# EAGLE design mainboard (EAGLE 9.6.2)
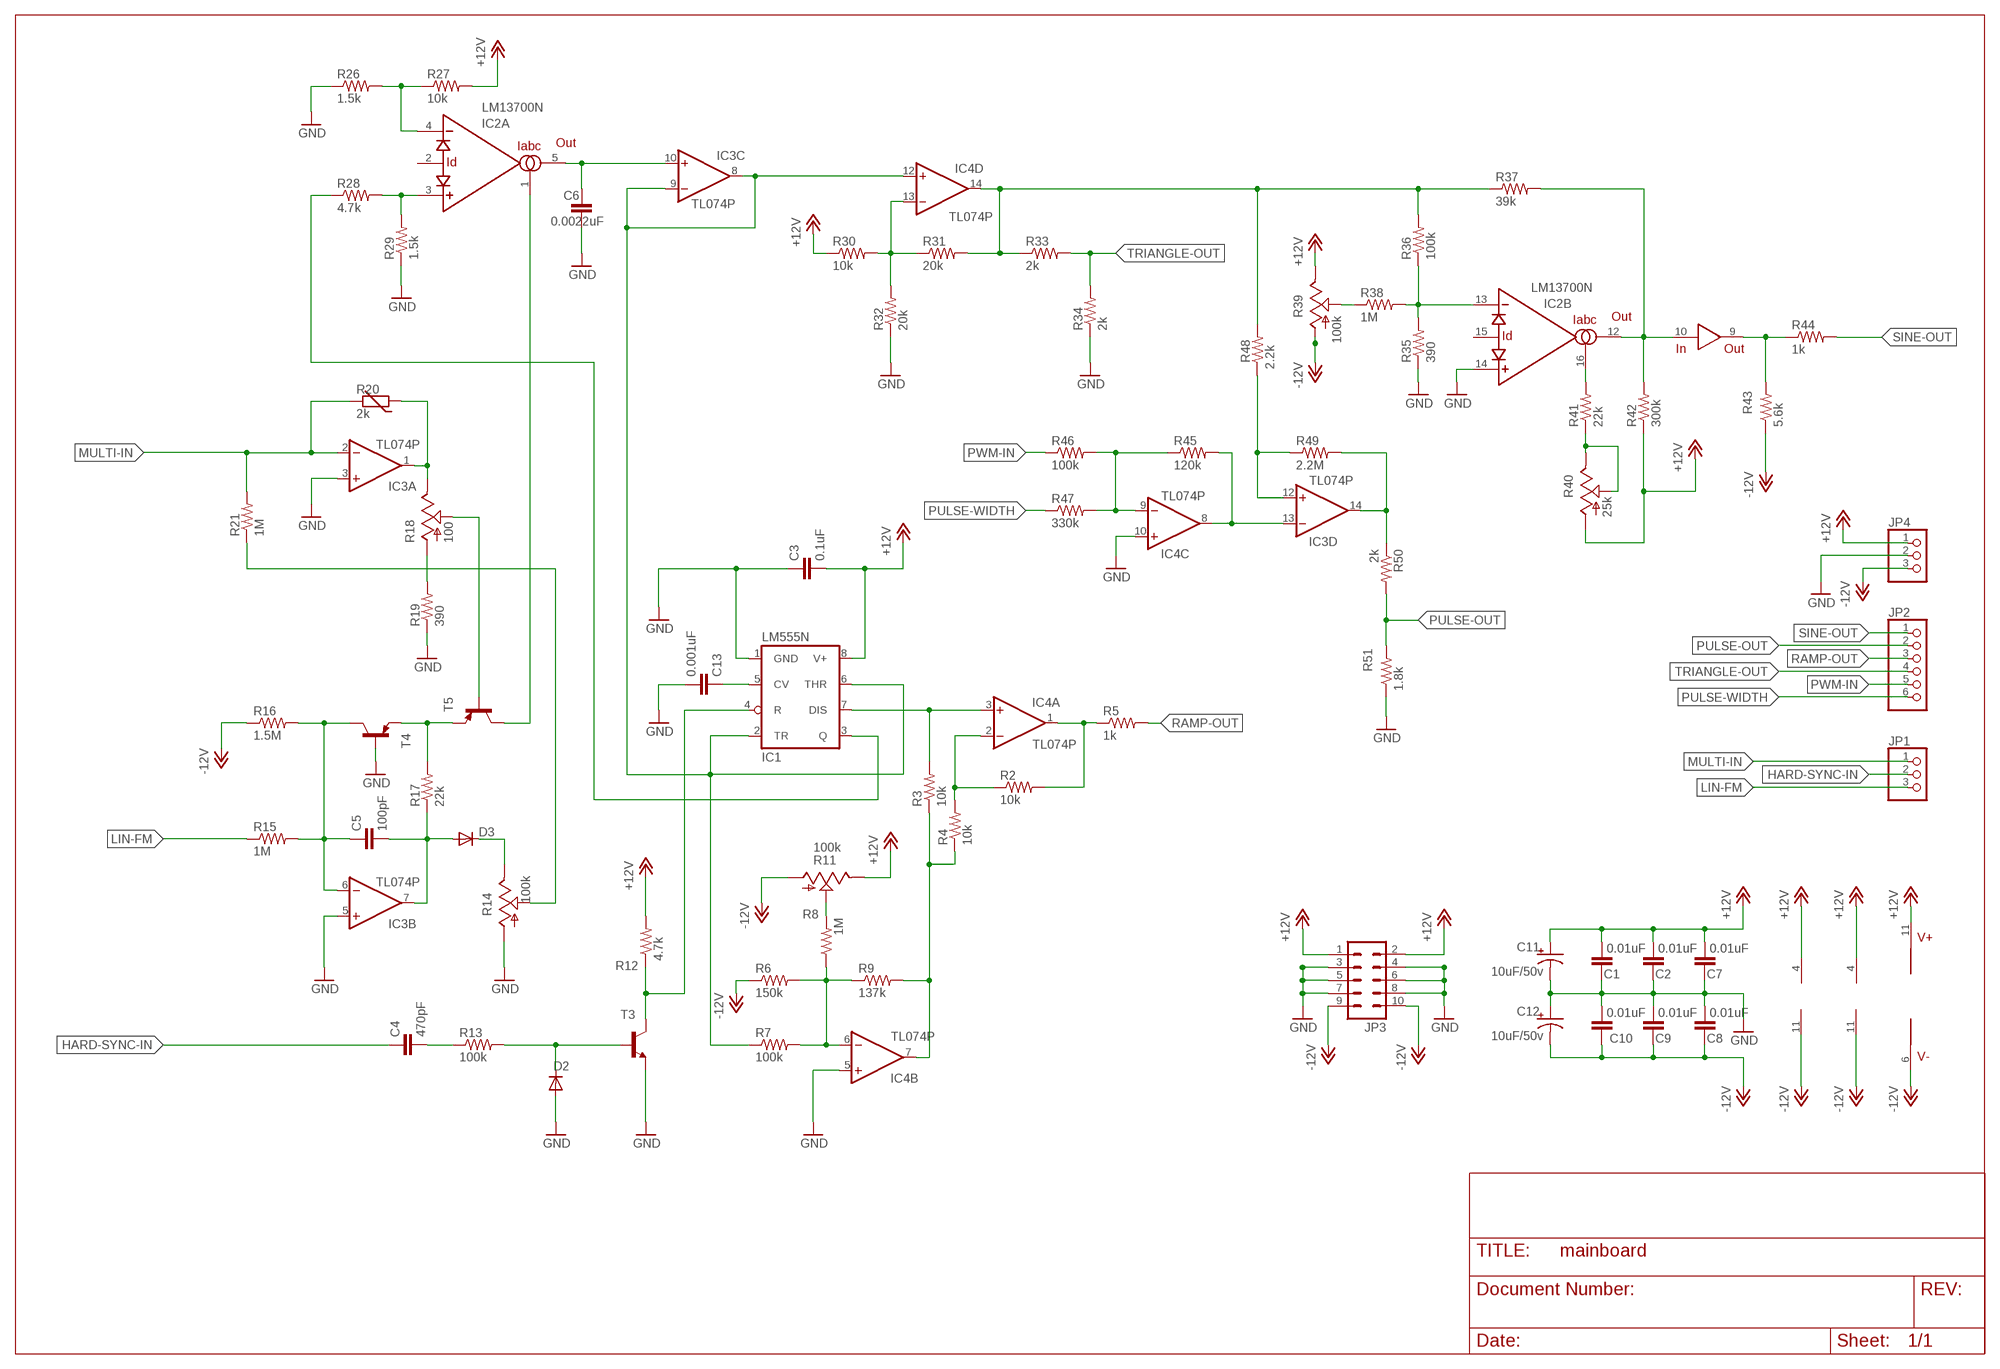
[diagram p0: schematic, sheet 1]

## Parts
C1  0.01uF  C-EU050-024X044  [C050-024X044]
C2  0.01uF  C-EU050-024X044  [C050-024X044]
C3  0.1uF  C-EU050-024X044  [C050-024X044]
C4  470pF  C-EU050-024X044  [C050-024X044]
C5  100pF  C-EU050-024X044  [C050-024X044]
C6  0.0022uF  C-EU050-025X075  [C050-025X075]
C7  0.01uF  C-EU050-024X044  [C050-024X044]
C8  0.01uF  C-EU050-024X044  [C050-024X044]
C9  0.01uF  C-EU050-024X044  [C050-024X044]
C10  0.01uF  C-EU050-024X044  [C050-024X044]
C11  10uF/50v  CPOL-USE2.5-6  [E2,5-6]
C12  10uF/50v  CPOL-USE2.5-6  [E2,5-6]
C13  0.001uF  C-EU050-024X044  [C050-024X044]
D2  1N4148DO35-7  [DO35-7]
D3  1N4148DO35-7  [DO35-7]
IC1  LM555N  [DIL08]
IC2  LM13700N  [DIL16]
IC3  TL074P  [DIL14]
IC4  TL074P  [DIL14]
JP1  PINHD-1X3  [1X03]
JP2  PINHD-1X6  [1X06]
JP3  ML10  [ML10]
JP4  PINHD-1X3  [1X03]
R2  10k  R-US_0204/7  [0204/7]
R3  10k  R-US_0204/7  [0204/7]
R4  10k  R-US_0204/7  [0204/7]
R5  1k  R-US_0204/7  [0204/7]
R6  150k  R-US_0204/7  [0204/7]
R7  100k  R-US_0204/7  [0204/7]
R8  1M  R-US_0204/7  [0204/7]
R9  137k  R-US_0204/7  [0204/7]
R11  100k  TRIM_US-RJ9W  [RJ9W]
R12  4.7k  R-US_0204/7  [0204/7]
R13  100k  R-US_0204/7  [0204/7]
R14  100k  TRIM_US-RJ9W  [RJ9W]
R15  1M  R-US_0204/7  [0204/7]
R16  1.5M  R-US_0204/7  [0204/7]
R17  22k  R-US_0204/7  [0204/7]
R18  100  TRIM_US-RJ9W  [RJ9W]
R19  390  R-US_0204/7  [0204/7]
R20  2k  THERMISTOR-5  [R-5]
R21  1M  R-US_0204/7  [0204/7]
R26  1.5k  R-US_0204/7  [0204/7]
R27  10k  R-US_0204/7  [0204/7]
R28  4.7k  R-US_0204/7  [0204/7]
R29  1.5k  R-US_0204/7  [0204/7]
R30  10k  R-US_0204/7  [0204/7]
R31  20k  R-US_0204/7  [0204/7]
R32  20k  R-US_0204/7  [0204/7]
R33  2k  R-US_0204/7  [0204/7]
R34  2k  R-US_0204/7  [0204/7]
R35  390  R-US_0204/7  [0204/7]
R36  100k  R-US_0204/7  [0204/7]
R37  39k  R-US_0204/7  [0204/7]
R38  1M  R-US_0204/7  [0204/7]
R39  100k  TRIM_US-RJ9W  [RJ9W]
R40  25k  TRIM_US-RJ9W  [RJ9W]
R41  22k  R-US_0204/7  [0204/7]
R42  300k  R-US_0204/7  [0204/7]
R43  5.6k  R-US_0204/7  [0204/7]
R44  1k  R-US_0204/7  [0204/7]
R45  120k  R-US_0204/7  [0204/7]
R46  100k  R-US_0204/7  [0204/7]
R47  330k  R-US_0204/7  [0204/7]
R48  2.2k  R-US_0204/7  [0204/7]
R49  2.2M  R-US_0204/7  [0204/7]
R50  2k  R-US_0204/7  [0204/7]
R51  1.8k  R-US_0204/7  [0204/7]
T3  2N3904-NPN-TO92-EBC  [TO92-EBC]
T4  2N3906-PNP-TO92-EBC  [TO92-EBC]
T5  2N3906-PNP-TO92-EBC  [TO92-EBC]

## Nets
+12V: C1.2 C2.2 C3.2 C7.2 C11.+ IC1.8(V+) IC2.11(V+) IC3.4(P:V+) IC4.4(P:V+) JP3.1 JP3.2 JP4.1 R11.E R12.2 R27.2 R30.1 R39.E R40.A R42.1
-12V: C8.1 C9.1 C10.1 C12.- IC2.6(V-) IC3.11(P:V-) IC4.11(P:V-) JP3.9 JP3.10 JP4.3 R6.1 R11.A R16.1 R39.A R43.1
GND: C1.1 C2.1 C3.1 C6.2 C7.1 C8.2 C9.2 C10.2 C11.- C12.+ C13.1 D2.A IC1.1(GND) IC2.14(B:+IN) IC3.3(A:+IN) IC3.5(B:+IN) IC4.5(B:+IN) IC4.10(C:+IN) JP3.3 JP3.4 JP3.5 JP3.6 JP3.7 JP3.8 JP4.2 R14.A R19.1 R26.1 R29.1 R32.1 R34.1 R35.1 R51.1 T3.E T4.B
HARD-SYNC-IN: C4.1 JP1.2
LIN-FM: JP1.3 R15.1
MULTI-IN: IC3.2(A:-IN) JP1.1 R20.2 R21.2
N$1: IC1.7(DIS) IC4.3(A:+IN) R3.2
N$2: IC4.2(A:-IN) R2.1 R4.2
N$3: IC4.1(A:OUT) R2.2 R5.1
N$4: IC4.7(B:OUT) R3.1 R4.1 R9.2
N$5: IC4.6(B:-IN) R6.2 R7.2 R8.1 R9.1
N$7: R38.1 R39.S
N$8: C5.1 IC3.6(B:-IN) R15.2 R16.2 T4.C
N$9: R8.2 R11.S
N$10: C5.2 D3.A IC3.7(B:OUT) R17.1
N$11: C4.2 R13.1
N$12: D2.C R13.2 T3.B
N$13: IC1.4(R) R12.1 T3.C
N$14: R17.2 T4.E T5.E
N$15: D3.C R14.E
N$16: R14.S R21.1
N$17: IC3.1(A:OUT) R18.E R20.1
N$18: R18.S T5.B
N$19: IC2.1(A:IABC) T5.C
N$20: R18.A R19.2
N$22: IC2.3(A:+IN) R28.2 R29.2
N$23: IC1.3(Q) R28.1
N$24: IC2.4(A:-IN) R26.2 R27.1
N$25: C6.1 IC2.5(A:OUT) IC3.10(C:+IN)
N$26: IC1.2(TR) IC1.6(THR) IC3.8(C:OUT) IC3.9(C:-IN) IC4.12(D:+IN) R7.1
N$27: IC4.13(D:-IN) R30.2 R31.1 R32.2
N$28: IC2.13(B:-IN) R35.2 R36.1 R38.2
N$29: IC4.14(D:OUT) R31.2 R33.1 R36.2 R37.1 R48.2
N$30: IC2.16(B:IABC) R41.2
N$31: R40.E R40.S R41.1
N$32: IC2.10(IN) IC2.12(B:OUT) R37.2 R42.2
N$33: IC2.9(OUT) R43.2 R44.1
N$34: IC3.13(D:-IN) IC4.8(C:OUT) R45.2
N$35: C13.2 IC1.5(CV)
N$37: IC4.9(C:-IN) R45.1 R46.2 R47.2
N$41: IC3.12(D:+IN) R48.1 R49.1
N$42: IC3.14(D:OUT) R49.2 R50.1
PULSE-OUT: JP2.2 R50.2 R51.2
PULSE-WIDTH: JP2.6 R47.1
PWM-IN: JP2.5 R46.1
RAMP-OUT: JP2.3 R5.2
SINE-OUT: JP2.1 R44.2
TRIANGLE-OUT: JP2.4 R33.2 R34.2
Unconnected: IC2.2(A:ID) IC2.7(IN) IC2.8(OUT) IC2.15(B:ID)

## Library data of the parts
C1-C10 C13 = resistor:C-EU: CAPACITOR, European symbol
C11 C12 = resistor:CPOL-US: POLARIZED CAPACITOR, American symbol
D2 D3 = diode:1N4148: DIODE high speed (Philips)
IC1 = linear:*555: TIMER
IC2 = synthdiy:LM13700: National Dual OTA with buffers.
IC3 IC4 = linear:TL074: OP AMP
JP1 JP4 = pinhead:PINHD-1X3: PIN HEADER
JP2 = pinhead:PINHD-1X6: PIN HEADER
JP3 = con-ml:ML10: HARTING; OC_FARNELL: unknown; OC_NEWARK: unknown
R2-R9 R12 R13 R15-R17 R19 R21 R26-R38 R41-R51 = resistor:R-US_: RESISTOR, American symbol
R11 R14 R18 R39 R40 = pot:TRIM_US-: POTENTIOMETER
R20 = varistor:THERMISTOR: THERMISTOR
T3 = transistor-neu-to92:*-NPN-: NPN Transistror
T4 T5 = transistor-neu-to92:*-PNP-: PNP Transistror

## Board
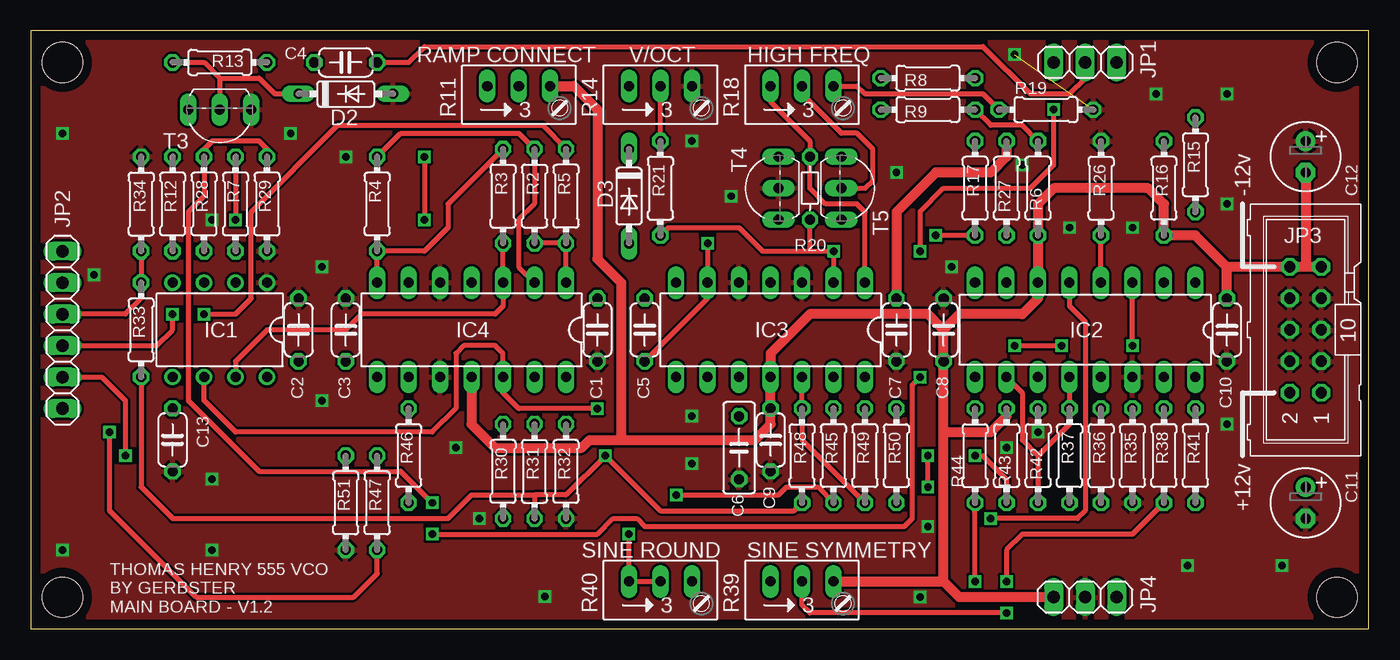
[diagram p1: board, top side]
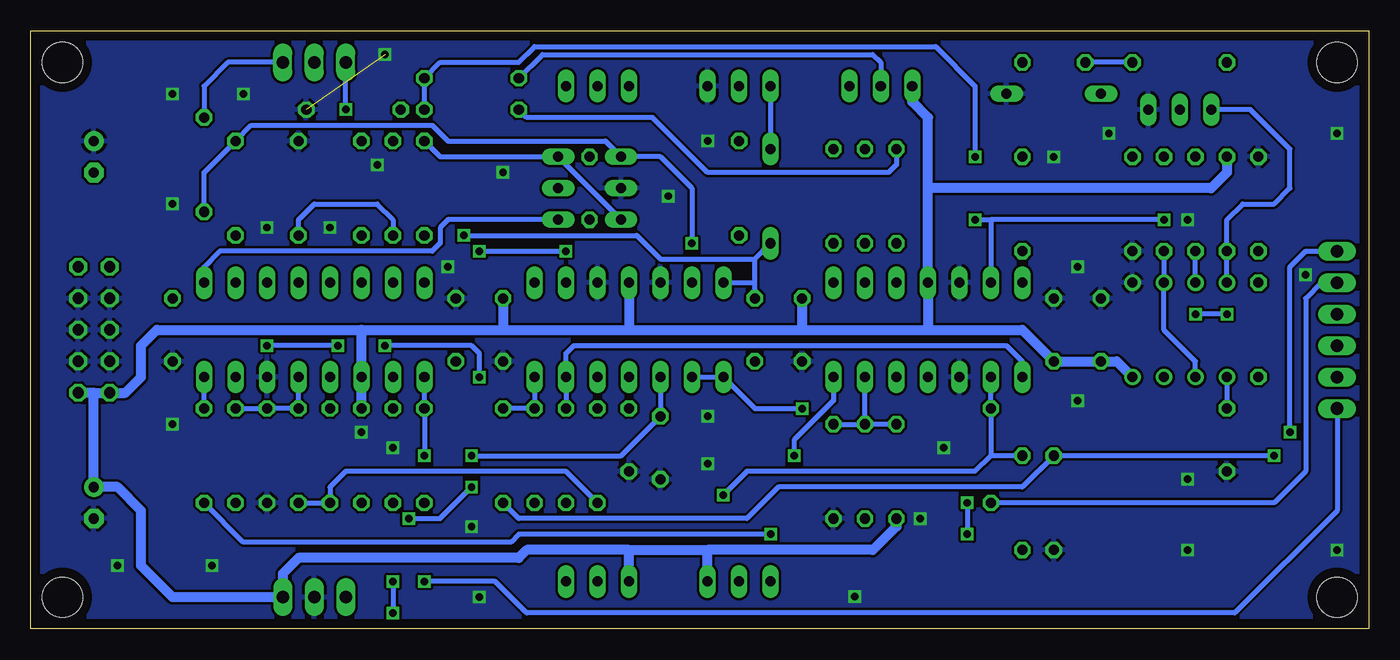
[diagram p2: board, bottom side, seen from below]

Size 107.95 x 48.26 mm. Coordinates in mm from the lower left corner, seen from the top.
Outline: 107.95,0 107.95,48.26 0,48.26 0,0 107.95,0
Copper layers (1*16): Top 0.035mm / dielectric 1.5mm / Bottom 0.035mm
Design rules "PCBWay": minimum track width 10mil, minimum drill 6mil, track to track 8mil, track to pad 8mil, pad to pad 8mil, via to via 8mil, smd to smd 8mil, copper to edge 30mil, drill to drill 8mil, minimum pad ring 10mil, minimum via ring 8mil, stop-mask expansion 4mil, vias tented up to drill 0mil, thermal gap 10mil
Holes 3.21 mm at 2.54,45.72 2.54,2.54 105.41,2.54 105.41,45.72

### Footprints (pad centres in the part's own frame; a part is rotated, then mirrored left to right if it is on the bottom)
C050-024X044 = drill 0.813 octagon: 1 -2.54,0; 2 2.54,0
C050-025X075 = drill 0.813 octagon: 1 -2.54,0; 2 2.54,0
E2,5-6 = drill 0.813 pad 1.6: + -1.27,0 | drill 0.813 pad 1.6 octagon: - 1.27,0
DO35-7 = drill 0.813 long: A 3.81,0; C -3.81,0
DIL08 = drill 0.813 pad 1.27: 1 -3.81,-3.81; 2 -1.27,-3.81; 3 1.27,-3.81; 4 3.81,-3.81; 5 3.81,3.81; 6 1.27,3.81; 7 -1.27,3.81; 8 -3.81,3.81
DIL16 = drill 0.813 long: 1 -8.89,-3.81; 2 -6.35,-3.81; 3 -3.81,-3.81; 4 -1.27,-3.81; 5 1.27,-3.81; 6 3.81,-3.81; 7 6.35,-3.81; 8 8.89,-3.81; 9 8.89,3.81; 10 6.35,3.81; 11 3.81,3.81; 12 1.27,3.81; 13 -1.27,3.81; 14 -3.81,3.81; 15 -6.35,3.81; 16 -8.89,3.81
DIL14 = drill 0.813 long: 1 -7.62,-3.81; 2 -5.08,-3.81; 3 -2.54,-3.81; 4 0,-3.81; 5 2.54,-3.81; 6 5.08,-3.81; 7 7.62,-3.81; 8 7.62,3.81; 9 5.08,3.81; 10 2.54,3.81; 11 0,3.81; 12 -2.54,3.81; 13 -5.08,3.81; 14 -7.62,3.81
1X03 = drill 1.016 long: 1 -2.54,0; 2 0,0; 3 2.54,0
1X06 = drill 1.016 long: 1 -6.35,0; 2 -3.81,0; 3 -1.27,0; 4 1.27,0; 5 3.81,0; 6 6.35,0
ML10 = drill 0.914 octagon: 1 -5.08,-1.27; 2 -5.08,1.27; 3 -2.54,-1.27; 4 -2.54,1.27; 5 0,-1.27; 6 0,1.27; 7 2.54,-1.27; 8 2.54,1.27; 9 5.08,-1.27; 10 5.08,1.27
0204/7 = drill 0.813 octagon: 1 -3.81,0; 2 3.81,0
RJ9W = drill 0.813 long: A 2.54,0.635; E -2.54,0.635; S 0,0.635
R-5 = drill 0.813 octagon: 1 -2.54,0; 2 2.54,0
TO92-EBC = drill 0.813 long: B 0,-1.27; C 2.54,-1.27; E -2.54,-1.27

### Placement (x,y rotation side)
C1  45.72,24.13 90 top
C2  21.59,24.13 270 top
C3  25.4,24.13 270 top
C4  25.4,45.72 180 top
C5  49.53,24.13 90 top
C6  57.15,14.61 270 top
C7  69.85,24.13 90 top
C8  73.66,24.13 90 top
C9  59.69,15.24 270 top
C10  96.52,24.13 270 top
C11  102.87,10.16 270 top
C12  102.87,38.1 270 top
C13  11.43,15.24 90 top
D2  25.4,43.18 0 top
D3  48.26,34.92 270 top
IC1  15.24,24.13 180 top
IC2  85.09,24.13 180 top
IC3  59.69,24.13 180 top
IC4  35.56,24.13 180 top
JP1  85.09,45.72 0 top
JP2  2.54,24.13 90 top
JP3  102.87,24.13 90 top
JP4  85.09,2.54 180 top
R2  40.64,34.92 270 top
R3  38.1,34.92 270 top
R4  27.94,34.29 90 top
R5  43.18,34.92 90 top
R6  81.28,35.56 90 top
R7  16.51,34.29 90 top
R8  72.39,44.45 180 top
R9  72.39,41.91 180 top
R11  39.37,43.18 0 top
R12  11.43,34.29 90 top
R13  15.24,45.72 180 top
R14  50.8,43.18 0 top
R15  93.98,37.47 270 top
R16  91.44,35.56 90 top
R17  76.2,35.56 90 top
R18  62.23,43.18 0 top
R19  81.92,41.91 180 top
R20  62.87,35.56 270 top
R21  50.8,35.56 270 top
R26  86.36,35.56 270 top
R27  78.74,35.56 90 top
R28  13.97,34.29 90 top
R29  19.05,34.29 90 top
R30  38.1,12.7 90 top
R31  40.64,12.7 270 top
R32  43.18,12.7 90 top
R33  8.89,24.13 90 top
R34  8.89,34.29 270 top
R35  88.9,13.97 90 top
R36  86.36,13.97 270 top
R37  83.82,13.97 90 top
R38  91.44,13.97 90 top
R39  62.23,3.17 0 top
R40  50.8,3.17 0 top
R41  93.98,13.97 90 top
R42  81.28,13.97 270 top
R43  78.74,13.97 270 top
R44  76.2,13.97 270 top
R45  64.77,13.97 90 top
R46  30.48,13.97 90 top
R47  27.94,10.16 90 top
R48  62.23,13.97 270 top
R49  67.31,13.97 90 top
R50  69.85,13.97 270 top
R51  25.4,10.16 90 top
T3  15.24,40.64 180 top
T4  59.05,35.56 90 top
T5  66.67,35.56 270 top

### Tracks (layer width: path | path; a pad name or v marks a point on that pad's centre or on a via)
+12V
  Top 0.813: R27.2 78.74,38.1 77.47,36.83 73.03,36.83 69.85,33.66 C7.2
  Bottom 0.813: 102.87,19.05 JP3.2 100.33,19.05 99.06,20.32 99.06,22.86 97.79,24.13 81.28,24.13 | 102.87,19.05 JP3.1 | R42.1 IC2.11 81.28,24.13 | C7.2 69.85,24.13 | 69.85,24.13 59.69,24.13 | 81.28,24.13 69.85,24.13 | IC3.4 59.69,24.13 | 59.69,24.13 45.72,24.13 | C1.2 45.72,24.13 | 45.72,24.13 35.56,24.13 | 35.56,24.13 IC4.4 35.56,35.56 | 35.56,24.13 27.94,24.13 C3.2 C2.2 20.32,21.59 IC1.8 | 35.56,35.56 35.56,41.27 36.83,42.55 R11.E | R12.2 11.43,36.83 12.7,35.56 35.56,35.56 | 102.87,19.05 C11.+ 100.97,11.43 99.06,9.53 99.06,5.08 96.52,2.54 JP4.1 87.63,4.45 86.36,5.71 68.58,5.71 67.94,6.35 59.69,6.35 | 53.34,6.35 40.01,6.35 38.1,8.26 R30.1 | R39.E 59.69,6.35 | 59.69,6.35 53.34,6.35 | R40.A 53.34,6.35
-12V
  Top 0.813: C12.- 102.87,29.21 | JP3.9 102.87,29.21 | 102.87,29.21 JP3.10 96.52,29.21 | C10.1 96.52,29.21 | 96.52,29.21 93.98,31.75 R16.1 91.44,34.29 90.17,35.56 82.55,35.56 81.28,34.29 R6.1 IC2.6 81.28,26.67 80.01,25.4 74.93,25.4 73.66,24.13 | 73.66,24.13 C8.1 73.66,15.88 | 73.66,24.13 72.39,25.4 62.87,25.4 59.69,22.23 IC3.11 C9.1 59.69,16.51 58.42,15.24 47.62,15.24 | 73.66,15.88 77.47,15.88 78.74,17.14 R43.1 | IC4.11 35.56,16.51 37.47,14.61 44.45,14.61 45.09,15.24 47.62,15.24 | R39.A 73.66,3.81 | 73.66,3.81 74.93,2.54 JP4.3 | 73.66,3.81 73.66,15.88 | R11.A 43.81,43.81 45.72,41.91 45.72,29.84 47.62,27.94 47.62,15.24
GND  (via drill 0.6)  (1 unrouted)
  other vias: 41.48,2.6 34.29,14.61 78.74,14.61 72.39,8.26 14.61,6.35 23.5,18.41 14.61,12.06 14.61,33.02 25.4,38.1 23.5,29.21 2.54,40.01 81.28,15.88 93.34,5.08 96.52,43.18 90.81,43.18 2.54,6.35 53.34,39.37 56.52,34.92 96.52,16.51 53.34,17.14 20.95,40.01 96.52,34.29 100.97,5.08 36.2,8.89 88.9,32.38 83.82,32.38 5.08,28.57 53.34,13.34 69.85,36.83 74.3,29.21 71.75,2.54 79.38,46.35 80.01,37.47
  pour Top: 0,48.26 0,0 107.95,0 107.95,48.26
  pour Bottom: 0,48.26 0,0 107.95,0 107.95,48.26
HARD-SYNC-IN
  Top 0.406: C4.1 30.48,45.72 31.75,46.99 76.83,46.99 80.64,43.18 83.82,43.18 85.09,44.45 JP1.2
LIN-FM
  Bottom 0.406: JP1.3 92.08,45.72 93.98,43.81 R15.1
MULTI-IN  (via drill 0.6)
  Top 0.406: v82.55,41.91 82.55,37.47 80.64,35.56 73.66,35.56 71.75,33.66 v71.75,30.48 | 62.87,30.48 R20.2 | R21.2 51.44,32.38 57.15,32.38 59.05,30.48 62.87,30.48 | 62.87,30.48 v64.77,30.48 IC3.2
  Bottom 0.406: v82.55,41.91 JP1.1 | v71.75,30.48 v64.77,30.48
N$1
  Top 0.406: R3.2 IC4.3 38.1,26.04 37.47,25.4 26.67,25.4 25.4,24.13 19.05,24.13 16.51,21.59 IC1.7
N$2
  Top 0.406: R4.2 29.84,40.01 39.37,40.01 R2.1 40.64,34.29 39.37,33.02 39.37,29.21 IC4.2
N$3
  Top 0.406: IC4.1 R5.1 R2.2
N$4
  Top 0.406: IC4.7 R4.1 31.75,30.48 33.66,32.38 33.66,34.29 R3.1
  Bottom 0.406: R3.1 38.1,37.47 38.73,36.83 53.34,36.83 57.78,41.27 67.94,41.27 R9.2
N$5  (via drill 0.6)
  Top 0.406: R6.2 80.01,40.64 77.47,40.64 R9.1 | R7.2 v16.51,33.02 | v31.75,38.1 v31.75,33.02
  Bottom 0.406: v16.51,33.02 30.48,33.02 | 30.48,33.02 IC4.6 | R9.1 R8.1 74.93,45.72 68.58,45.72 67.31,46.99 34.92,46.99 31.75,43.81 v31.75,38.1 | v31.75,33.02 30.48,33.02
N$7  (via drill 0.6)
  Top 0.406: R38.1 88.9,7.62 80.01,7.62 78.74,6.35 v78.74,3.81 | v78.74,1.27 62.87,1.27 62.23,1.91 R39.S
  Bottom 0.406: v78.74,3.81 v78.74,1.27
N$8  (via drill 0.6)
  Top 0.406: C5.1 54.61,26.67 IC3.6 v54.61,31.11
  Bottom 0.406: v54.61,31.11 54.61,35.56 57.15,38.1 T4.C 61.59,39.37 74.3,39.37 75.56,40.64 90.17,40.64 R16.2 93.98,36.83 R15.2
N$9
  Bottom 0.406: R8.2 66.67,46.35 40.01,46.35 39.37,45.72 R11.S
N$10  (via drill 0.6)
  Top 0.406: R17.1 v73.03,31.75
  Bottom 0.406: C5.2 49.53,27.94 | IC3.7 49.53,27.94 | 49.53,27.94 49.53,29.84 | 49.53,29.84 D3.A | v73.03,31.75 59.05,31.75 57.15,29.84 49.53,29.84
N$11
  Bottom 0.406: R13.1 C4.2
N$12
  Top 0.406: 15.24,44.45 T3.B | R13.2 13.97,45.72 15.24,44.45 | 15.24,44.45 18.41,44.45 19.68,43.18 D2.C
N$13
  Bottom 0.406: IC1.4 R12.1 11.43,33.02 10.16,34.29 7.62,34.29 6.35,35.56 6.35,38.73 9.53,41.91 T3.C
N$14
  Bottom 0.406: T4.E T5.E 74.93,38.1 R17.2
N$15
  Bottom 0.406: R14.E D3.C
N$16
  Top 0.406: R21.1 R14.S
N$17
  Top 0.406: R18.E 59.69,42.55 62.87,39.37 R20.1 62.87,35.56 64.14,34.29 66.67,34.29 67.31,33.66 IC3.1
N$18
  Top 0.406: T5.B 67.31,35.56 67.94,36.2 67.94,38.73 66.67,40.01 65.41,40.01 62.23,43.18 R18.S
N$19
  Bottom 0.406: T5.C 74.3,33.02 74.93,32.38 74.93,31.11 75.56,30.48 92.71,30.48 93.98,29.21 IC2.1
N$20
  Top 0.406: R18.A 66.67,43.81 67.31,43.18 76.83,43.18 R19.2
N$22  (via drill 0.6)
  Top 0.406: R29.2 19.05,38.73 18.41,39.37 14.61,39.37 13.97,38.73 R28.2 13.97,34.92 12.7,33.66 12.7,18.41 18.41,12.7 29.84,12.7 v32.38,10.16 | v32.38,7.62 45.72,7.62 46.99,8.89 48.9,8.89 49.53,8.26 70.48,8.26 71.12,8.89 71.12,19.68 v71.75,20.32 | v79.38,22.86 v83.19,22.86 | v88.9,22.86 IC2.3
  Bottom 0.406: v32.38,10.16 v32.38,7.62 | v71.75,20.32 71.75,22.23 72.39,22.86 v79.38,22.86 | v83.19,22.86 v88.9,22.86
N$23
  Bottom 0.406: IC1.3 R28.1
N$24
  Top 0.406: IC2.4 R26.2
  Bottom 0.406: R26.2 86.36,33.02 85.09,34.29 80.01,34.29 78.74,33.02 R27.1
N$25  (via drill 0.6)
  Top 0.406: IC2.5 83.82,26.04 85.09,24.77 85.09,9.53 84.45,8.89 v77.47,8.89 | v72.39,11.43 v72.39,13.97
  Bottom 0.406: IC3.10 C6.1 60.33,13.97 v72.39,13.97 | v77.47,8.89 74.93,8.89 v72.39,11.43
N$26  (via drill 0.6)
  Top 0.406: v45.72,17.78 39.37,17.78 38.1,19.05 IC4.12 38.1,22.23 37.47,22.86 34.92,22.86 34.29,22.23 34.29,17.78 32.38,15.88 16.51,15.88 13.97,18.41 IC1.6
  Bottom 0.406: IC1.6 13.97,21.59 16.51,24.13 IC1.2 R7.1 | IC3.9 IC3.8 49.53,17.78 v45.72,17.78
N$27
  Bottom 0.406: R30.2 R31.1 | R31.1 IC4.13 | R32.2 R31.1
N$28
  Bottom 0.406: IC2.13 R36.1 R35.2 R38.2
N$29  (via drill 0.6)
  Top 0.406: 40.64,10.79 43.18,10.79 v46.35,13.97 50.8,9.53 61.59,9.53 R48.2 | R33.1 8.89,11.43 11.43,8.89 33.66,8.89 35.56,10.79 40.64,10.79 | 40.64,10.79 R31.2
  Bottom 0.406: R36.2 R37.1 83.82,11.43 82.55,12.7 64.77,12.7 R48.2 | IC4.14 43.18,18.41 46.35,15.24 v46.35,13.97
N$30
  Bottom 0.406: R41.2 IC2.16
N$31  (via drill 0.6)
  Top 0.406: v48.26,7.62 R40.E R40.S
  Bottom 0.406: v48.26,7.62 68.58,7.62 69.22,6.99 90.81,6.99 R41.1
N$32
  Top 0.406: IC2.12 R37.2 83.82,16.51 81.28,13.97 | 81.28,13.97 R42.2 | IC2.10 80.01,19.05 80.01,15.24 81.28,13.97
N$33  (via drill 0.6)
  Top 0.406: v76.2,13.97 76.83,13.97 78.74,12.06 R43.2
  Bottom 0.406: IC2.9 R44.1 v76.2,13.97
N$34
  Bottom 0.406: R45.2 IC3.13 64.77,22.23 64.14,22.86 29.21,22.86 27.94,21.59 IC4.8
N$35
  Bottom 0.406: IC1.5 C13.2
N$37  (via drill 0.6)
  Top 0.406: v52.07,10.79 60.33,10.79 60.96,11.43 63.5,11.43 R45.1
  Bottom 0.406: IC4.9 R46.2 30.48,13.97 | R47.2 30.48,13.97 | 30.48,13.97 31.75,12.7 50.16,12.7 v52.07,10.79
N$41
  Top 0.406: IC3.12 R48.1 62.23,15.24 R49.1
N$42
  Bottom 0.406: IC3.14 R49.2 R50.1
PULSE-OUT  (via drill 0.6)
  Top 0.406: JP2.2 5.71,20.32 7.62,18.41 v7.62,13.97
  Bottom 0.406: v7.62,13.97 R51.2 27.94,11.43 47.62,11.43 50.16,8.89 68.58,8.89 R50.2
PULSE-WIDTH  (via drill 0.6)
  Top 0.406: v6.35,15.88 6.35,9.53 13.34,2.54 26.04,2.54 27.94,4.45 R47.1
  Bottom 0.406: v6.35,15.88 6.35,29.21 5.08,30.48 JP2.6
PWM-IN
  Bottom 0.406: JP2.5 3.81,27.94 5.08,26.67 5.08,12.7 7.62,10.16 R46.1
RAMP-OUT  (via drill 0.6)
  Top 0.406: JP2.3 10.16,22.86 11.43,24.13 v11.43,25.4 | v13.97,25.4 16.51,25.4 17.78,26.67 17.78,33.66 24.77,40.64 41.27,40.64 R5.2
  Bottom 0.406: v11.43,25.4 v13.97,25.4
SINE-OUT  (via drill 0.6)
  Top 0.406: v76.2,3.81 R44.2
  Bottom 0.406: JP2.1 2.54,9.53 10.79,1.27 67.94,1.27 70.48,3.81 v76.2,3.81
TRIANGLE-OUT
  Top 0.406: R34.2 R33.2 8.89,26.67 7.62,25.4 JP2.4

### Text on the board
tNames: RAMP CONNECT | V/OCT | HIGH FREQ | -12v | +12v | SINE ROUND | SINE SYMMETRY | THOMAS HENRY 555 VCO / BY GERBSTER / MAIN BOARD - V1.2